# EAGLE design Adafruit Cobbler Plus (EAGLE 6.6.0)
COMPANY: ADAFRUIT INDUSTRIES; DRAWN: KTOWN; REV: A
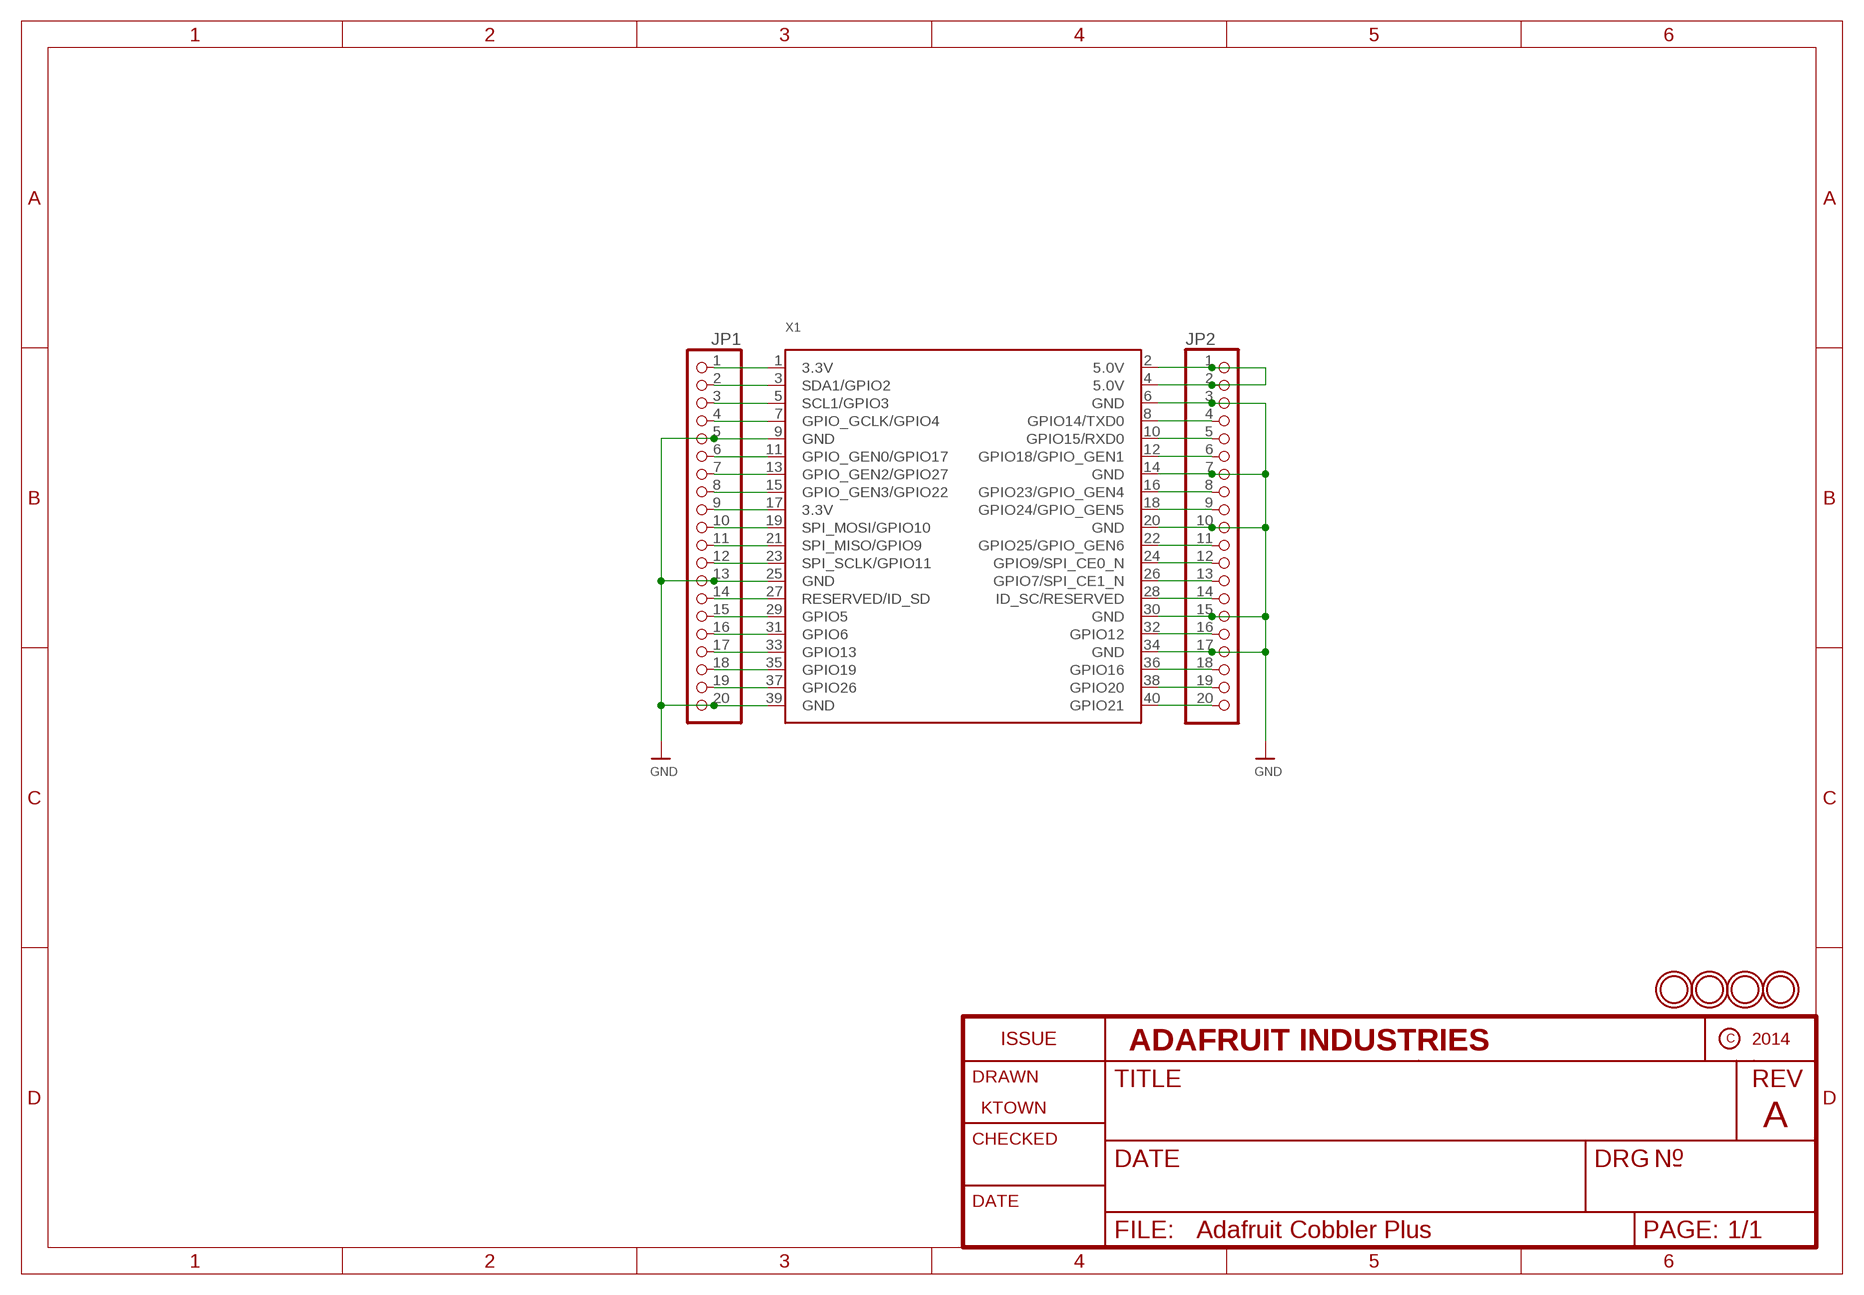
[diagram p0: schematic, sheet 1]

## Parts
JP1  HEADER-1X20ROUND  [1X20_ROUND]
JP2  HEADER-1X20ROUND  [1X20_ROUND]
U$1  MOUNTINGHOLE2.5_THICK  [MOUNTINGHOLE_2.5_PLATED_THICK]
U$2  MOUNTINGHOLE2.5_THICK  [MOUNTINGHOLE_2.5_PLATED_THICK]
U$3  MOUNTINGHOLE2.5_THICK  [MOUNTINGHOLE_2.5_PLATED_THICK]
U$4  MOUNTINGHOLE2.5_THICK  [MOUNTINGHOLE_2.5_PLATED_THICK]
X1  RASPBERRYPI_B+_IDC  [RASPBERRYPI_B+_IDC]

## Nets
GND: JP1.5 JP1.13 JP1.20 JP2.3 JP2.7 JP2.10 JP2.15 JP2.17 X1.6(GND) X1.9(GND) X1.14(GND) X1.20(GND) X1.25(GND) X1.30(GND) X1.34(GND) X1.39(GND)
N$1: JP2.1 JP2.2 X1.2(5.0V) X1.4(5.0V)
N$4: JP2.4 X1.8(GPIO14/TXD0)
N$5: JP2.5 X1.10(GPIO15/RXD0)
N$6: JP2.6 X1.12(GPIO18/GPIO_GEN1)
N$8: JP2.8 X1.16(GPIO23/GPIO_GEN4)
N$9: JP2.9 X1.18(GPIO24/GPIO_GEN5)
N$11: JP2.11 X1.22(GPIO25/GPIO_GEN6)
N$12: JP2.12 X1.24(GPIO9/SPI_CE0_N)
N$13: JP2.13 X1.26(GPIO7/SPI_CE1_N)
N$14: JP2.14 X1.28(ID_SC/RESERVED)
N$16: JP2.16 X1.32(GPIO12)
N$18: JP2.18 X1.36(GPIO16)
N$19: JP2.19 X1.38(GPIO20)
N$20: JP2.20 X1.40(GPIO21)
N$21: JP1.1 X1.1(3.3V)
N$22: JP1.2 X1.3(SDA1/GPIO2)
N$23: JP1.3 X1.5(SCL1/GPIO3)
N$24: JP1.4 X1.7(GPIO_GCLK/GPIO4)
N$26: JP1.6 X1.11(GPIO_GEN0/GPIO17)
N$27: JP1.7 X1.13(GPIO_GEN2/GPIO27)
N$28: JP1.8 X1.15(GPIO_GEN3/GPIO22)
N$29: JP1.9 X1.17(3.3V)
N$30: JP1.10 X1.19(SPI_MOSI/GPIO10)
N$31: JP1.11 X1.21(SPI_MISO/GPIO9)
N$32: JP1.12 X1.23(SPI_SCLK/GPIO11)
N$34: JP1.14 X1.27(RESERVED/ID_SD)
N$35: JP1.15 X1.29(GPIO5)
N$36: JP1.16 X1.31(GPIO6)
N$37: JP1.17 X1.33(GPIO13)
N$38: JP1.18 X1.35(GPIO19)
N$39: JP1.19 X1.37(GPIO26)

## Library data of the parts
JP1 JP2 = microbuilder:HEADER-1X20
U$1-U$4 = microbuilder:MOUNTINGHOLE: Mounting Hole For #2 screws (0.086"/2.18mm width, 0.094"/2.4mm hole) use 2.5mm; BOM: EXCLUDE
X1 = microbuilder:RASPBERRYPI_B+_IDC

## Board
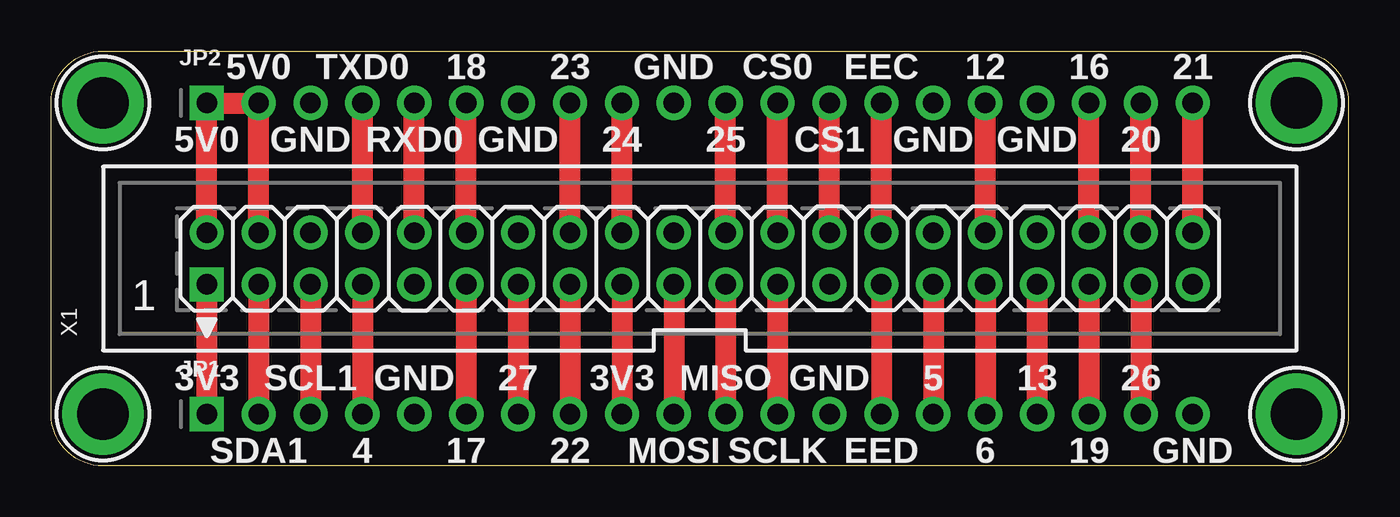
[diagram p1: board, top side]
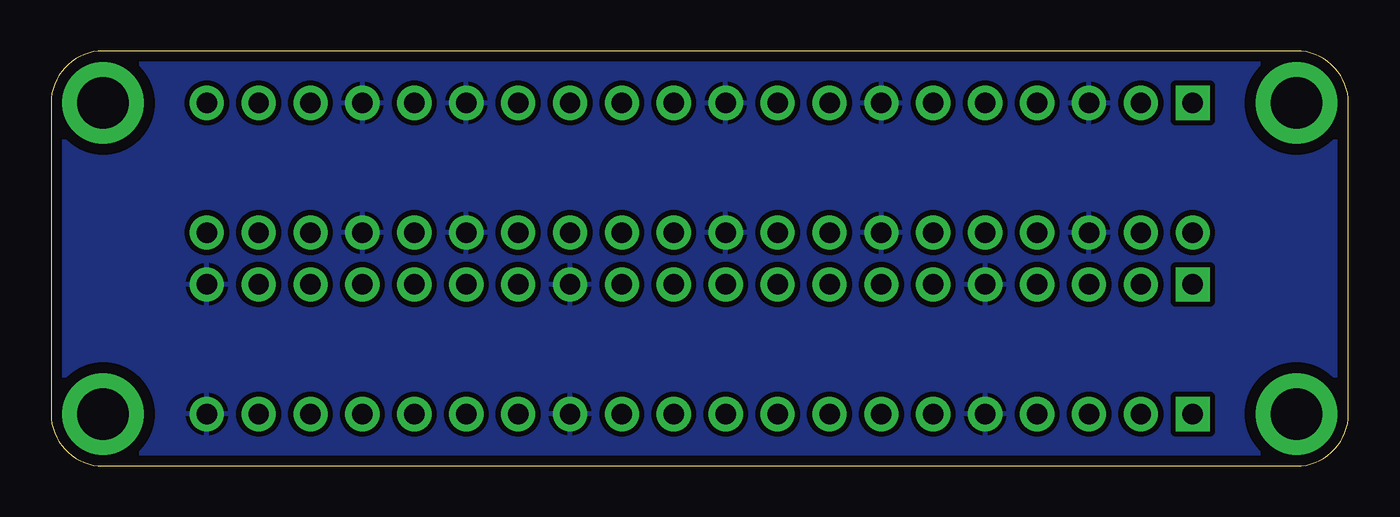
[diagram p2: board, bottom side, seen from below]

Size 63.5 x 20.32 mm. Coordinates in mm from the lower left corner, seen from the top.
Outline: 0,2.54 0,17.78 arc-90 2.54,20.32 60.96,20.32 arc-90 63.5,17.78 63.5,2.54 arc-90 60.96,0 2.54,0 arc-90 0,2.54
Copper layers (1*16): Top 0.035mm / dielectric 1.5mm / Bottom 0.035mm
Design rules "default": minimum track width 8mil, minimum drill 0.4mm, track to track 8mil, track to pad 8mil, pad to pad 8mil, via to via 8mil, smd to smd 8mil, copper to edge 20mil, drill to drill 8mil, minimum pad ring 8mil, minimum via ring 10mil, stop-mask expansion 3mil, vias tented up to drill 0mil, thermal gap 8mil

### Footprints (pad centres in the part's own frame; a part is rotated, then mirrored left to right if it is on the bottom)
1X20_ROUND = drill 1 pad 1.676 square: 1 -24.13,0 | drill 1 pad 1.676: 2 -21.59,0; 3 -19.05,0; 4 -16.51,0; 5 -13.97,0; 6 -11.43,0; 7 -8.89,0; 8 -6.35,0; 9 -3.81,0; 10 -1.27,0; 11 1.27,0; 12 3.81,0; 13 6.35,0; 14 8.89,0; 15 11.43,0; 16 13.97,0; 17 16.51,0; 18 19.05,0; 19 21.59,0; 20 24.13,0
MOUNTINGHOLE_2.5_PLATED_THICK = drill 2.5 pad 4: P$1 0,0
RASPBERRYPI_B+_IDC = drill 1 pad 1.676 square: 1 -1.27,24.13 | drill 1 pad 1.676: 2 1.27,24.13; 3 -1.27,21.59; 4 1.27,21.59; 5 -1.27,19.05; 6 1.27,19.05; 7 -1.27,16.51; 8 1.27,16.51; 9 -1.27,13.97; 10 1.27,13.97; 11 -1.27,11.43; 12 1.27,11.43; 13 -1.27,8.89; 14 1.27,8.89; 15 -1.27,6.35; 16 1.27,6.35; 17 -1.27,3.81; 18 1.27,3.81; 19 -1.27,1.27; 20 1.27,1.27; 21 -1.27,-1.27; 22 1.27,-1.27; 23 -1.27,-3.81; 24 1.27,-3.81; 25 -1.27,-6.35; 26 1.27,-6.35; 27 -1.27,-8.89; 28 1.27,-8.89; 29 -1.27,-11.43; 30 1.27,-11.43; 31 -1.27,-13.97; 32 1.27,-13.97; 33 -1.27,-16.51; 34 1.27,-16.51; 35 -1.27,-19.05; 36 1.27,-19.05; 37 -1.27,-21.59; 38 1.27,-21.59; 39 -1.27,-24.13; 40 1.27,-24.13

### Placement (x,y rotation side)
JP1  31.75,2.54 0 top
JP2  31.75,17.78 0 top
U$1  2.54,17.78 0 top
U$2  60.96,17.78 0 top
U$3  2.54,2.54 0 top
U$4  60.96,2.54 0 top
X1  31.75,10.16 90 top

### Tracks (layer width: path | path; a pad name or v marks a point on that pad's centre or on a via)
GND
  pour Bottom (isolate 0.254): 0,2.54 0,17.78 arc-90 2.54,20.32 60.96,20.32 arc-90 63.5,17.78 63.5,2.54 arc-90 60.96,0 2.54,0 arc-90
N$1
  Top 1.016: X1.2 JP2.1 JP2.2 X1.4
N$4
  Top 1.016: X1.8 JP2.4
N$5
  Top 1.016: X1.10 JP2.5
N$6
  Top 1.016: X1.12 JP2.6
N$8
  Top 1.016: X1.16 JP2.8
N$9
  Top 1.016: X1.18 JP2.9
N$11
  Top 1.016: X1.22 JP2.11
N$12
  Top 1.016: X1.24 JP2.12
N$13
  Top 1.016: X1.26 JP2.13
N$14
  Top 1.016: X1.28 JP2.14
N$16
  Top 1.016: X1.32 JP2.16
N$18
  Top 1.016: X1.36 JP2.18
N$19
  Top 1.016: X1.38 JP2.19
N$20
  Top 1.016: X1.40 JP2.20
N$21
  Top 1.016: X1.1 JP1.1
N$22
  Top 1.016: X1.3 JP1.2
N$23
  Top 1.016: X1.5 JP1.3
N$24
  Top 1.016: X1.7 JP1.4
N$26
  Top 1.016: X1.11 JP1.6
N$27
  Top 1.016: X1.13 JP1.7
N$28
  Top 1.016: X1.15 JP1.8
N$29
  Top 1.016: X1.17 JP1.9
N$30
  Top 1.016: X1.19 JP1.10
N$31
  Top 1.016: X1.21 JP1.11
N$32
  Top 1.016: X1.23 JP1.12
N$34
  Top 1.016: X1.27 JP1.14
N$35
  Top 1.016: X1.29 JP1.15
N$36
  Top 1.016: X1.31 JP1.16
N$37
  Top 1.016: X1.33 JP1.17
N$38
  Top 1.016: X1.35 JP1.18
N$39
  Top 1.016: X1.37 JP1.19

### Text on the board
tPlace: 5V0 | TXD0 | 18 | 23 | GND | CS0 | EEC | 12 | 16 | 21 | 5V0 | GND | RXD0 | GND | 24 | 25 | CS1 | GND | GND | 20 | 3V3 | SCL1 | GND | 27 | 3V3 | MISO | GND | 5 | 13 | 26 | SDA1 | 4 | 17 | 22 | MOSI | SCLK | EED | 6 | 19 | GND